# Altium schematic sheet USB HUB.SchDoc
size 381 x 254 mm
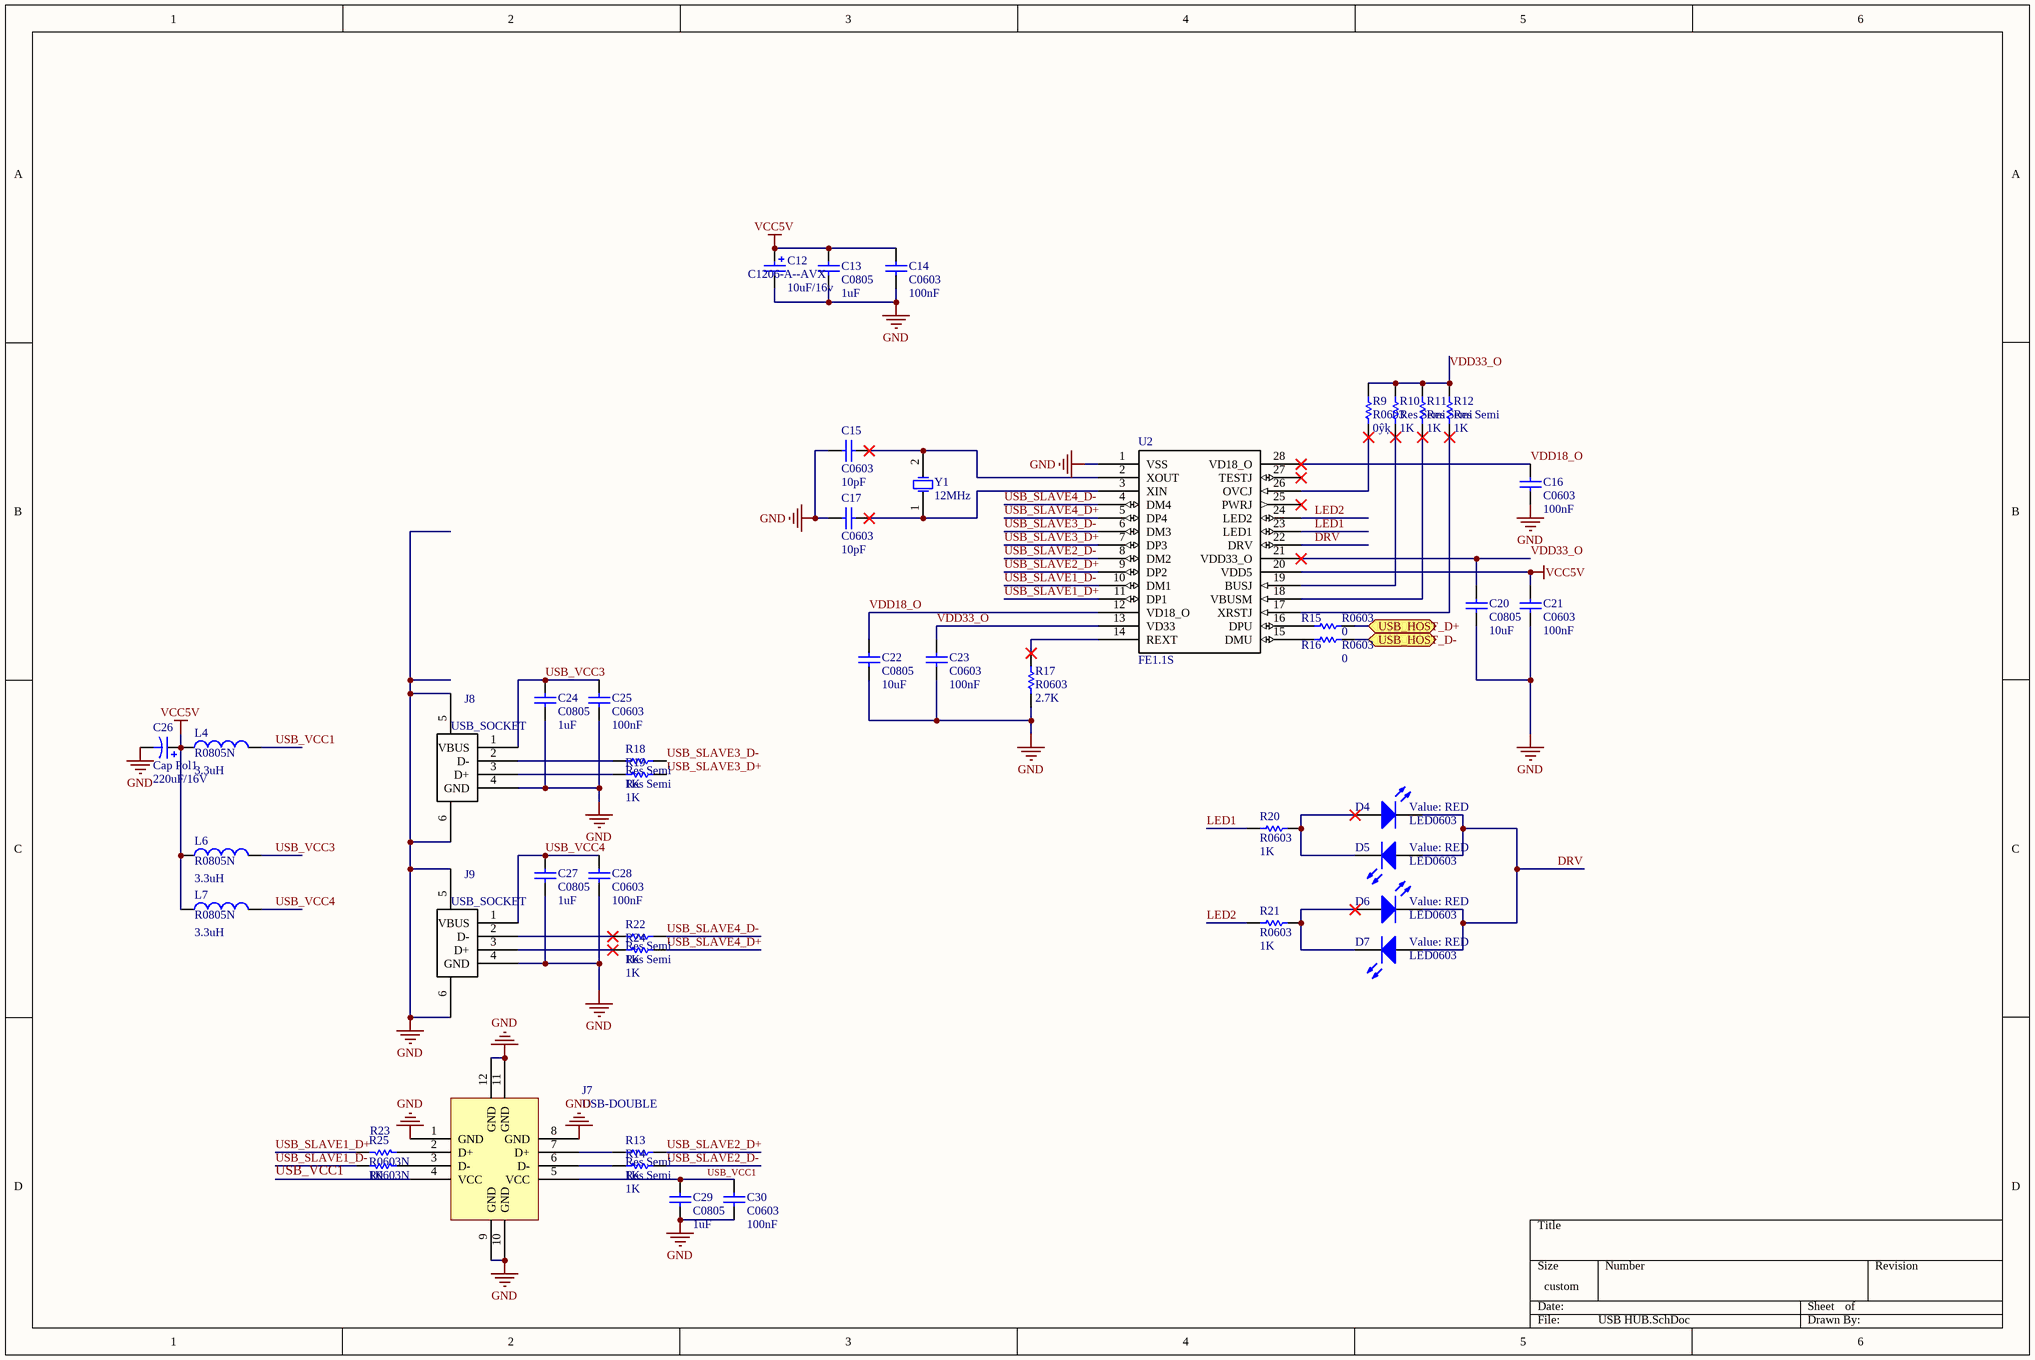
[diagram p0: USB HUB.SchDoc]

## Parts
C12  C1206-A--AVX  value 10uF/16v  [C1206-A]
C13  C0805  value 1uF  [C0805N]
C14  C0603  value 100nF  [C0603N]
C15  C0603  value 10pF  [C0603N]
C16  C0603  value 100nF  [C0603N]
C17  C0603  value 10pF  [C0603N]
C20  C0805  value 10uF  [C0805N]
C21  C0603  value 100nF  [C0603N]
C22  C0805  value 10uF  [C0805N]
C23  C0603  value 100nF  [C0603N]
C24  C0805  value 1uF  [C0805N]
C25  C0603  value 100nF  [C0603N]
C26  Cap Pol1  value 220uF/16V  [16V220U]
C27  C0805  value 1uF  [C0805N]
C28  C0603  value 100nF  [C0603N]
C29  C0805  value 1uF  [C0805N]
C30  C0603  value 100nF  [C0603N]
D4  LED0603  value RED  [LED0603]
D5  LED0603  value RED  [LED0603]
D6  LED0603  value RED  [LED0603]
D7  LED0603  value RED  [LED0603]
J7  USB-DOUBLE  [PCBComponent_1]
J8  USB_SOCKET  [USB-A-90-L]
J9  USB_SOCKET  [USB-A-90-L]
L4  R0805N  value 3.3uH  [R0805N]
L6  R0805N  value 3.3uH  [R0805N]
L7  R0805N  value 3.3uH  [R0805N]
R9  R0603  value 0ŷķ  [R0603N]
R10  Res Semi  value 1K  [R0603N]
R11  Res Semi  value 1K  [R0603N]
R12  Res Semi  value 1K  [R0603N]
R13  Res Semi  value 1K  [R0603N]
R14  Res Semi  value 1K  [R0603N]
R15  R0603  value 0  [R0603N]
R16  R0603  value 0  [R0603N]
R17  R0603  value 2.7K  [R0603N]
R18  Res Semi  value 1K  [R0603N]
R19  Res Semi  value 1K  [R0603N]
R20  R0603  value 1K  [R0603N]
R21  R0603  value 1K  [R0603N]
R22  Res Semi  value 1K  [R0603N]
R23  R0603N  [R0603N]
R24  Res Semi  value 1K  [R0603N]
R25  R0603N  value 1K  [R0603N]
U2  FE1.1S  [SSOP28]
Y1  12MHz  [XTAL_5032_2]

## Ports
USB_HOST_D+ (bidir), USB_HOST_D- (bidir)

## Nets
GND: C12.2 C13.1 C14.1 C15.2 C16.1 C17.2 C20.1 C21.1 C22.2 C23.2 C24.1 C25.1 C26.2 C27.1 C28.1 C29.1 C30.1 J7.1(GND) J7.8(GND) J7.9(GND) J7.10(GND) J7.11(GND) J7.12(GND) J8.4(GND) J8.5 J8.6 J9.4(GND) J9.5 J9.6 R17.1 U2.1(VSS)
VCC5V: C12.1 C13.2 C14.2 C21.2 C26.1 L4.1 L6.1 L7.1 U2.20(VDD5)
DRV: D4.2(K) D5.1(A) D6.2(K) D7.1(A) U2.22(DRV)
LED1: R20.2 U2.23(LED1)
LED2: R21.2 U2.24(LED2)
USB_HOST_D+: R15.2 ; port USB_HOST_D+
USB_HOST_D-: R16.2 ; port USB_HOST_D-
USB_SLAVE1_D+: R25.1 U2.11(DP1)
USB_SLAVE1_D-: R23.1 U2.10(DM1)
USB_SLAVE2_D+: R13.1 U2.9(DP2)
USB_SLAVE2_D-: R14.1 U2.8(DM2)
USB_SLAVE3_D+: R19.1 U2.7(DP3)
USB_SLAVE3_D-: R18.1 U2.6(DM3)
USB_SLAVE4_D+: R24.1 U2.5(DP4)
USB_SLAVE4_D-: R22.1 U2.4(DM4)
USB_VCC1: C29.2 C30.2 J7.4(VCC) J7.5(VCC) L4.2
USB_VCC3: C24.2 C25.2 J8.1(VBUS) L6.2
USB_VCC4: C27.2 C28.2 J9.1(VBUS) L7.2
VDD18_O: C16.2 C22.1 U2.12(VD18_O) U2.28(VD18_O)
VDD33_O: C20.2 C23.1 R9.2 R10.2 R11.2 R12.2 U2.13(VD33) U2.21(VDD33_O)
NetC15_1: C15.1 U2.2(XOUT) Y1.2(OSC2)
NetC17_1: C17.1 U2.3(XIN) Y1.1(OSC1)
NetD4_1: D4.1(A) D5.2(K) R20.1
NetD6_1: D6.1(A) D7.2(K) R21.1
NetJ7_2: J7.2(D+) R25.2
NetJ7_3: J7.3(D-) R23.2
NetJ7_6: J7.6(D-) R14.2
NetJ7_7: J7.7(D+) R13.2
NetJ8_2: J8.2(D-) R18.2
NetJ8_3: J8.3(D+) R19.2
NetJ9_2: J9.2(D-) R22.2
NetJ9_3: J9.3(D+) R24.2
NetR9_1: R9.1 U2.26(OVCJ)
NetR10_1: R10.1 U2.19(BUSJ)
NetR11_1: R11.1 U2.18(VBUSM)
NetR12_1: R12.1 U2.17(XRSTJ)
NetR15_1: R15.1 U2.16(DPU)
NetR16_1: R16.1 U2.15(DMU)
NetR17_2: R17.2 U2.14(REXT)

Not connected (* = marked no-connect by the designer): U2 25(PWRJ)* 27(TESTJ)*

## Library data of the parts
C12 = Cap Pol3: Polarized Capacitor (Surface Mount)
C13-C17 C20-C25 C27-C30 = Cap Semi: Capacitor (Semiconductor SIM Model)
C26 = Cap Pol1: Polarized Capacitor (Radial); Published: 8-Jun-2000; LatestRevisionDate: 17-Jul-2002; LatestRevisionNote: Re-released for DXP Platform.; PackageReference: RB7.6-15; Publisher: Altium Limited
D4-D7 = LED
J8 J9 = USB_SOCKET: USB_TYPEA_SOCKET
L4 L6 L7 = Inductor
R9-R25 = Res Semi: Semiconductor Resistor
  R10-R14 R18 R19 R22-R24: Published: 8-Jun-2000; LatestRevisionDate: 17-Jul-2002; LatestRevisionNote: Re-released for DXP Platform.; PackageReference: AXIAL-0.5; Publisher: Altium Limited
Y1 = XTAL: Crystal Oscillator